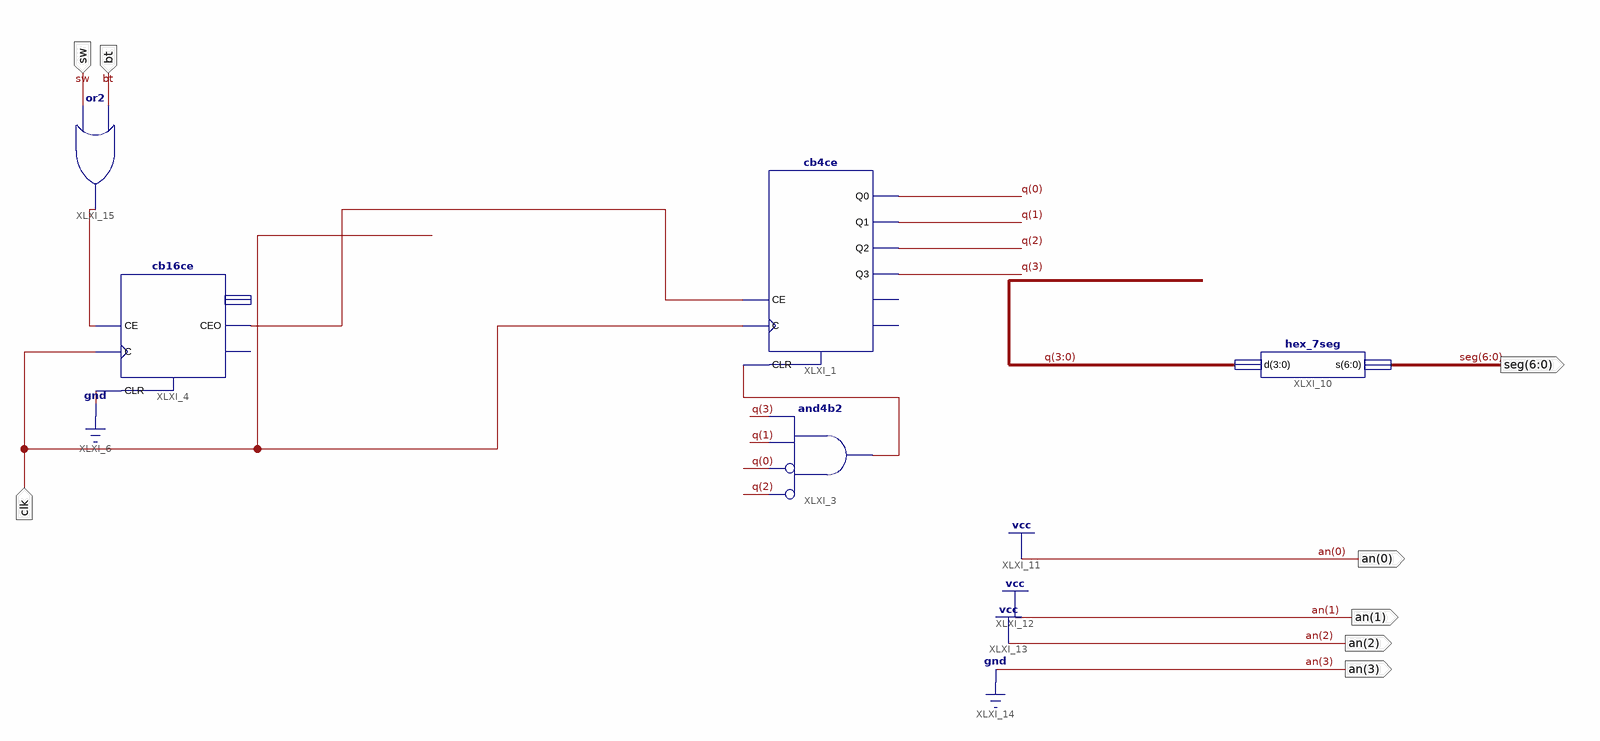
[diagram p0: schematic sheet 1]
// Xilinx ISE schematic kr_remake.sch (spartan3e) as structural Verilog: 5 symbols, 8 ports
module kr_remake (
  input  clk,
  input  sw,
  input  bt,
  output [6:0] seg,
  output [3:0] an
);

  wire XLXN_12, XLXN_21, XLXN_31;
  wire [3:0] q;

  cb4ce XLXI_1 (.C(clk), .CE(XLXN_21), .CLR(XLXN_12), .Q0(q[0]), .Q1(q[1]), .Q2(q[2]), .Q3(q[3]));  // open: CEO, TC
  and XLXI_3 (XLXN_12, ~q[2], ~q[0], q[1], q[3]);  // and4b2
  cb16ce XLXI_4 (.C(clk), .CE(XLXN_31), .CLR(1'b0), .CEO(XLXN_21));  // open: Q, TC
  hex_7seg XLXI_10 (.d(q), .s(seg));
  or XLXI_15 (XLXN_31, sw, bt);

  assign an = 4'b0111;
endmodule
